# EAGLE design pcd - Copia (EAGLE 9.3.2)
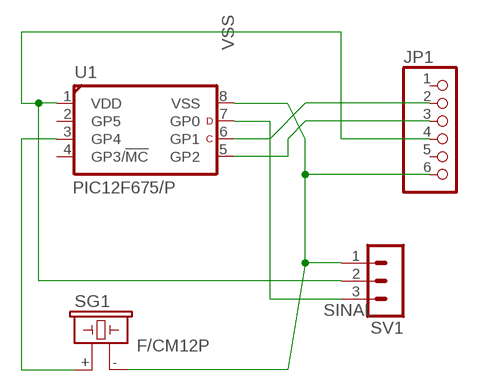
[diagram p0: schematic, sheet 1]

## Parts
JP1  PINHD-1X6  [1X06]
SG1  F/CM12P  [F/CM12P]
SV1  MA03-1  [MA03-1]
U1  PIC12F675/P  [DIL8-P]

## Nets
N$2: JP1.2 U1.6(GP1)
N$3: SG1.+ U1.3(GP4)
N$4: JP1.3 U1.5(GP2)
SINAL: SV1.3 U1.7(GP0)
VDD: JP1.4 SV1.2 U1.1(VDD)
VSS: JP1.6 SG1.- SV1.1 U1.8(VSS)
Unconnected: JP1.1 JP1.5 U1.2(GP5) U1.4(GP3/!MC!)

## Library data of the parts
JP1 = pinhead:PINHD-1X6: PIN HEADER
SG1 = buzzer:F/CM12P: BUZZER Source: Buerklin; OC_FARNELL: unknown; OC_NEWARK: unknown
SV1 = con-lstb:MA03-1: PIN HEADER; OC_FARNELL: unknown; OC_NEWARK: unknown
U1 = microchip_pic12f:PIC12F675: Low pincount microcontroller http://www.microchip.com/wwwproducts/Devices.aspx?product=PIC12F675 Properties Parameter Name Value Program Memory Type Flash Program Memory (KB) 1.75 CPU Speed (MIPS) 5 RAM Bytes 64 Data EEPROM (bytes) 128 Timers 1 x 8-bit, 1 x 16-bit ADC 4 ch, 10-bit Comparators 1 Temperature Range (C) -40 to 125 Operating Voltage Range (V) 2 to 5.5 Pin Count 8 Cap Touch Channels 4 Features 128 bytes of EEPROM data memory, Programmable pull-up resistors, MPLAB® ICD-2 programming support or debugging support with optional header adapter, 4 oscillator selections including 4 MHz RC oscillator with programmable calibration and Power-On Reset. Library from www.mikroelektroniikka.fi/lbr

## Board
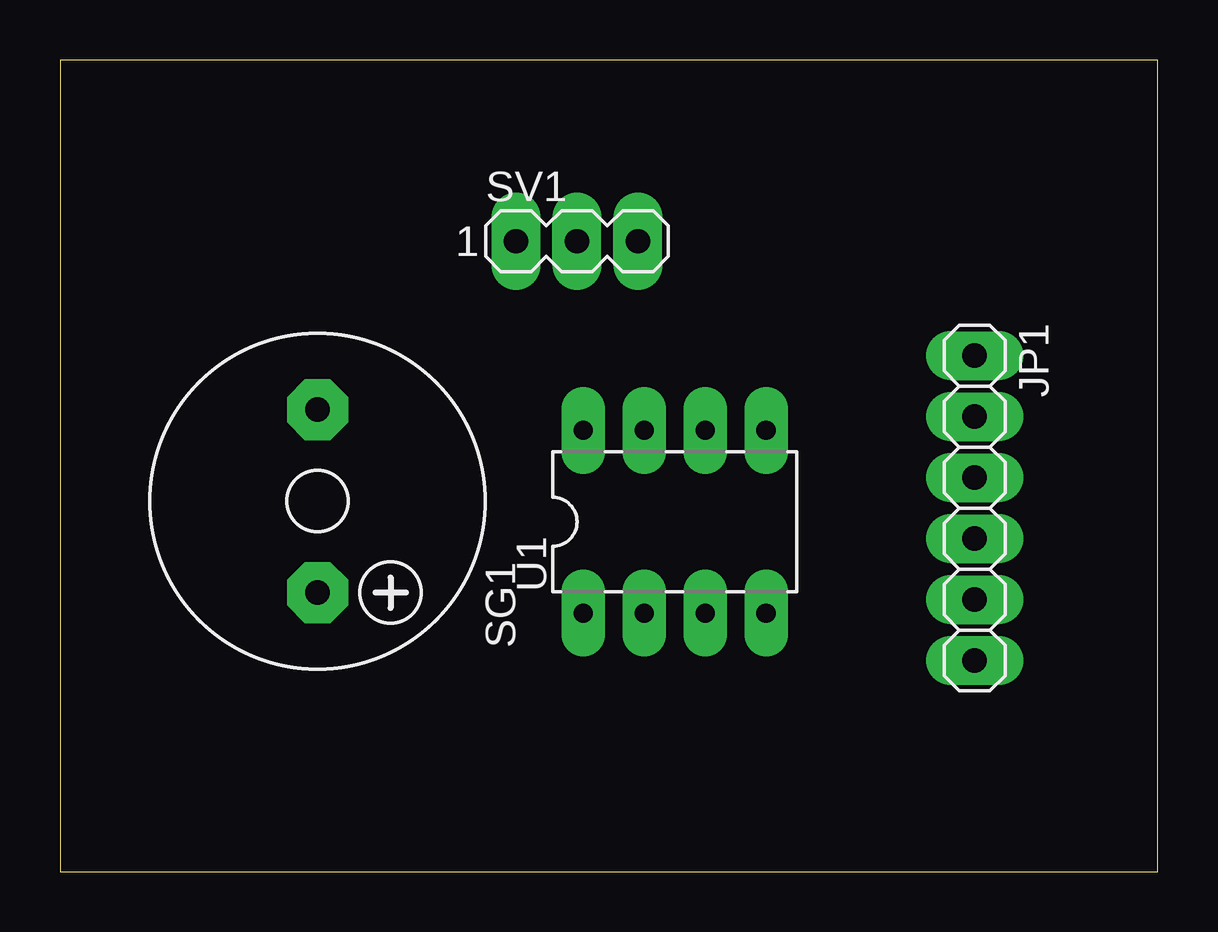
[diagram p1: board, top side]
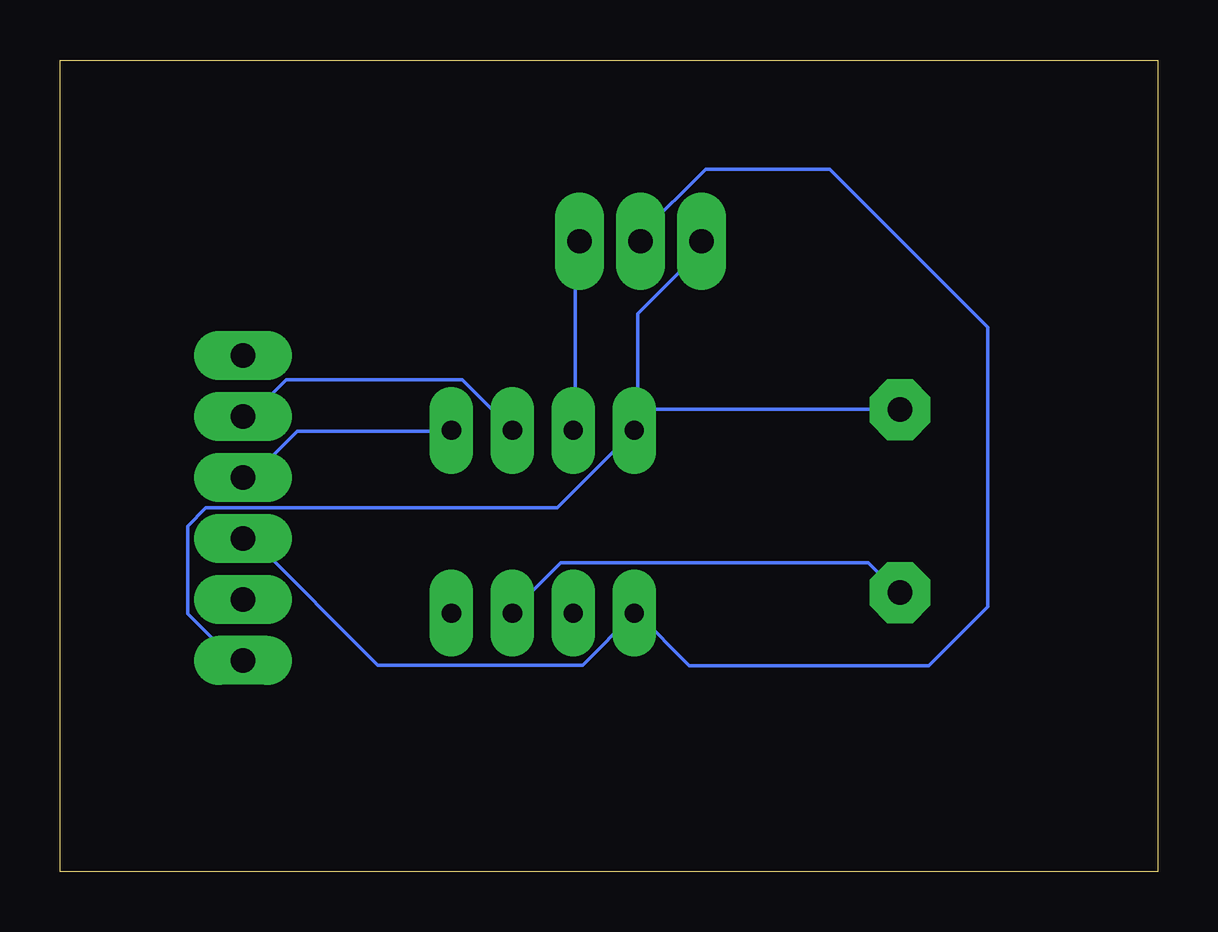
[diagram p2: board, bottom side, seen from below]

Size 45.73 x 33.83 mm. Coordinates in mm from the lower left corner, seen from the top.
Outline: 0,0 45.73,0 45.73,33.83 0,33.83 0,0
Copper layers (1*16): Top 0.035mm / dielectric 1.5mm / Bottom 0.035mm
Design rules "default *": minimum track width 6mil, minimum drill 0.35mm, track to track 6mil, track to pad 6mil, pad to pad 6mil, via to via 6mil, smd to smd 6mil, copper to edge 40mil, drill to drill 6mil, minimum pad ring 20mil, minimum via ring 8mil, stop-mask expansion 4mil, vias tented up to drill 0mil, thermal gap 10mil

### Footprints (pad centres in the part's own frame; a part is rotated, then mirrored left to right if it is on the bottom)
1X06 = drill 1.016 long: 1 -6.35,0; 2 -3.81,0; 3 -1.27,0; 4 1.27,0; 5 3.81,0; 6 6.35,0
F/CM12P = drill 1.016 pad 2.54 octagon: + 3.81,0; - -3.81,0
MA03-1 = drill 1.016 long: 1 -2.54,0; 2 0,0; 3 2.54,0
DIL8-P = drill 0.8 pad 1.3 long: 1 -3.81,-3.81; 2 -1.27,-3.81; 3 1.27,-3.81; 4 3.81,-3.81; 5 3.81,3.81; 6 1.27,3.81; 7 -1.27,3.81; 8 -3.81,3.81

### Placement (x,y rotation side)
JP1  38.11,15.16 270 top
SG1  10.73,15.45 270 top
SV1  21.54,26.28 0 top
U1  25.61,14.59 0 top

### Tracks (layer width: path | path; a pad name or v marks a point on that pad's centre or on a via)
N$2
  Bottom 0.152: U1.6 27,18.52 28.98,20.5 36.29,20.5 37.97,18.83 JP1.2
N$3
  Bottom 0.152: U1.3 26.85,10.9 24.86,12.89 12.06,12.89 10.84,11.67 SG1.+
N$4
  Bottom 0.152: U1.5 29.44,18.37 35.84,18.37 37.67,16.54 37.97,16.54 JP1.3
SINAL
  Bottom 0.152: U1.7 24.26,18.52 24.26,25.99 24.1,26.14 SV1.3
VDD
  Bottom 0.152: JP1.4 37.97,13.8 37.67,13.8 32.48,8.62 23.95,8.62 21.82,10.75 U1.1 21.66,10.75 19.5,8.59 9.53,8.59 7.07,11.06 7.07,22.7 13.65,29.28 18.83,29.28 21.51,26.6 21.51,26.3 SV1.2
VSS
  Bottom 0.152: 21.66,19.29 21.66,23.25 19.07,25.84 19.07,26.14 SV1.1 | 21.66,19.29 21.66,18.52 U1.8 | JP1.6 38.12,8.92 38.58,8.92 40.41,10.75 40.41,14.41 39.65,15.17 25.02,15.17 21.82,18.37 U1.8 | 21.66,19.29 10.84,19.29 SG1.- | 21.66,19.29 U1.8